# Altium schematic sheet Main.SchDoc
size A; Organization: Machine Intelligence Laboratory; Address1: 1889 Museum Rd; Address2: Room 3001; Address3: Gainesville, FL, 32611; SheetNumber: 1; SheetTotal: 1; Author1: YOUR NAME :)
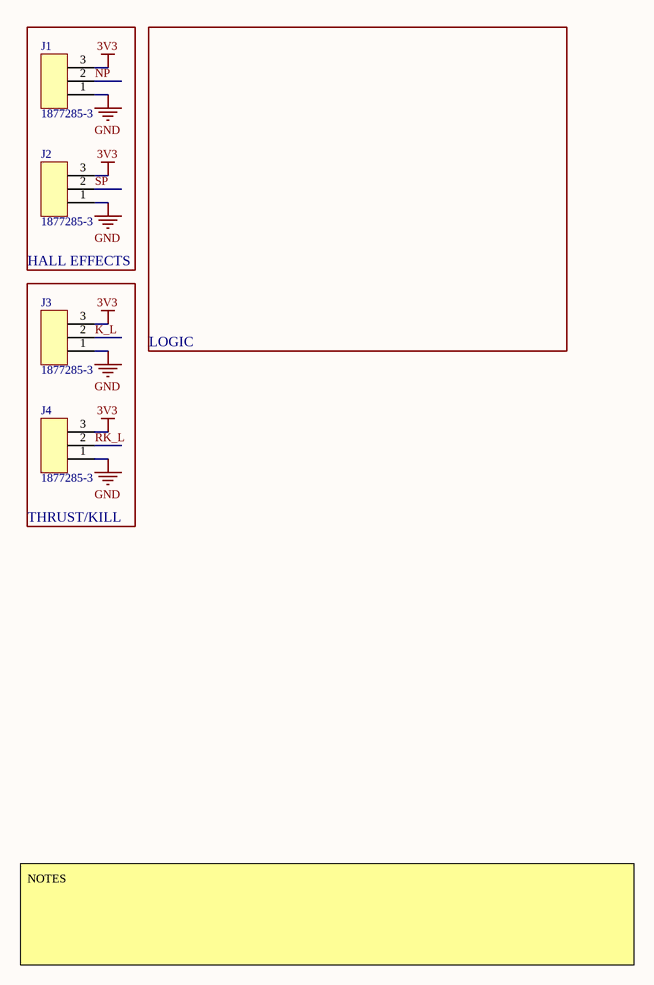
[diagram p0: Main.SchDoc]

## Parts
J1  1877285-3  [1877285-3]
J2  1877285-3  [1877285-3]
J3  1877285-3  [1877285-3]
J4  1877285-3  [1877285-3]

## Blocks framed on the sheet
HALL EFFECTS: J1 J2
THRUST/KILL: J3 J4

## Nets
3V3: J1.3 J2.3 J3.3 J4.3
GND: J1.1 J2.1 J3.1 J4.1
K_L: J3.2
NP: J1.2
RK_L: J4.2
SP: J2.2

## Notes on the sheet
- LOGIC
- NOTES
- Project/Vehicle:
- PLACE NOTES BOX HERE
- Author(s):
- -
- Revisor(s):
- Git Repo:
- Git Hash:
- Date:
- Revision:
- Size:
- A
- File:
- Sheet
- of

## Library data of the parts
J1-J4 = 1877285-3: Supplier 1: Digi-Key; Supplier Part Number 1: A99846-ND